# Altium schematic sheet clock.SchDoc
size A4
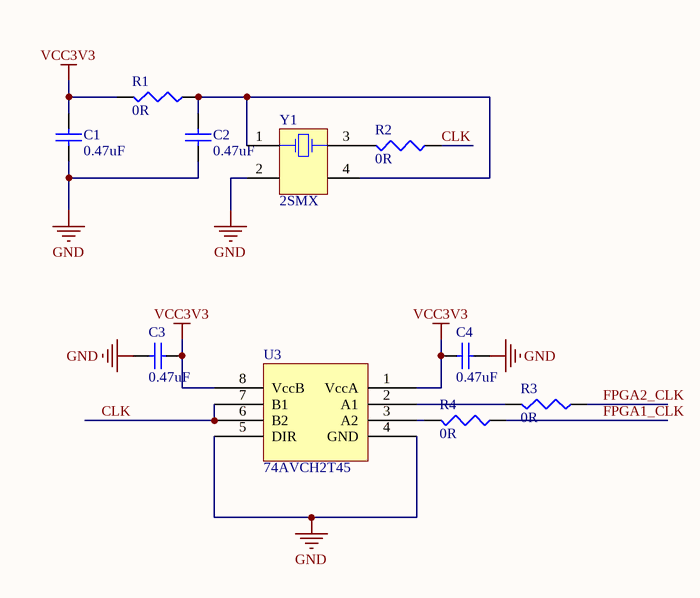
[diagram p0: clock.SchDoc]

## Parts
C1  0.47uF  [CAPC1005N]
C2  0.47uF  [CAPC1005N]
C3  0.47uF  [CAPC1005N]
C4  0.47uF  [CAPC1005N]
R1  0R  [RESC1005N]
R2  0R  [RESC1005N]
R3  0R  [RESC1005N]
R4  0R  [RESC1005N]
U3  74AVCH2T45  [SOT765-1]
Y1  2SMX  [SMX2]

## Nets
GND: C1.1 C2.1 C3.2 C4.1 U3.4(GND) U3.5(DIR) Y1.2(NC)
VCC3V3: C1.2 C3.1 C4.2 R1.2 U3.1(VccA) U3.8(VccB)
CLK: R2.1 U3.6(B2) U3.7(B1)
FPGA1_CLK: R4.1
FPGA2_CLK: R3.1
NetC2_2: C2.2 R1.1 Y1.1(OSC1) Y1.4(NC)
NetR2_2: R2.2 Y1.3(OSC2)
NetR3_2: R3.2 U3.2(A1)
NetR4_2: R4.2 U3.3(A2)

## Library data of the parts
C1-C4 = Cap Semi: Capacitor (Semiconductor SIM Model); Published: 8-Jun-2000; LatestRevisionDate: 29-May-2009; LatestRevisionNote: IPC-7351 Footprint Added.; PackageReference: C1206; Publisher: Altium Limited; PackageDescription: Chip Capacitor; Value: 0.47uF
R1-R4 = Res3: Resistor; Published: 8-Jun-2000; LatestRevisionDate: 29-May-2009; LatestRevisionNote: IPC-7351 Footprint Added.; PackageReference: J1-0603; Publisher: Altium Limited; PackageDescription: Chip Resistor; Value: 0R
Y1 = 2SMX: Surface Mount Quartz Crystal; Note: PCB layout complies with manufacturer's recommendation.; Published: 17-Jul-2002; DatasheetDocument: 9-Sep-1999; PackageDocument: 9-Sep-1999; PackageReference: 2SMX; Publisher: Altium Limited; ComponentLink1Description: Manufacturer Link; ComponentLink1URL: http://www.cmac.com/mt/